# Altium schematic sheet Sheet3.SchDoc
size A; SheetNumber: 1; SheetTotal: 3
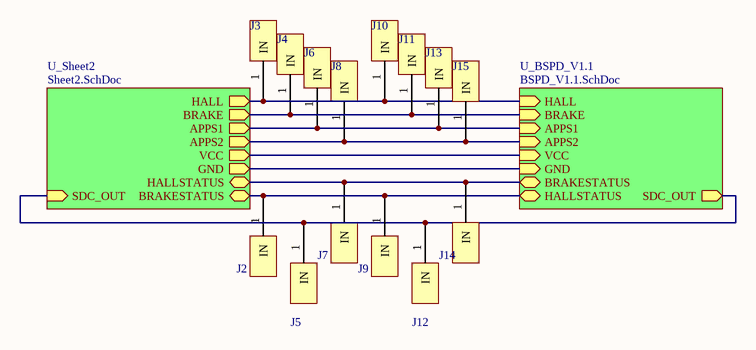
[diagram p0: Sheet3.SchDoc]

## Parts
J2  22AWG JUMPER  [22 AWG Hole]  (value not drawn)
J3  22AWG JUMPER  [22 AWG Hole]  (value not drawn)
J4  22AWG JUMPER  [22 AWG Hole]  (value not drawn)
J5  22AWG JUMPER  [22 AWG Hole]  (value not drawn)
J6  22AWG JUMPER  [22 AWG Hole]  (value not drawn)
J7  22AWG JUMPER  [22 AWG Hole]  (value not drawn)
J8  22AWG JUMPER  [22 AWG Hole]  (value not drawn)
J9  22AWG JUMPER  [22 AWG Hole]  (value not drawn)
J10  22AWG JUMPER  [22 AWG Hole]  (value not drawn)
J11  22AWG JUMPER  [22 AWG Hole]  (value not drawn)
J12  22AWG JUMPER  [22 AWG Hole]  (value not drawn)
J13  22AWG JUMPER  [22 AWG Hole]  (value not drawn)
J14  22AWG JUMPER  [22 AWG Hole]  (value not drawn)
J15  22AWG JUMPER  [22 AWG Hole]  (value not drawn)

## Sub-sheets
U_BSPD_V1.1 = BSPD_V1.1.SchDoc: SDC_OUT (out), HALL (in), BRAKE (in), APPS1 (in), APPS2 (in), VCC (in), GND (in), BRAKESTATUS (bidir), HALLSTATUS (bidir)
U_Sheet2 = Sheet2.SchDoc: SDC_OUT (in), HALL (out), BRAKE (out), APPS1 (out), APPS2 (out), VCC (out), GND (out), BRAKESTATUS (bidir), HALLSTATUS (bidir)

## Nets
NetJ2_1: J2.1(IN) J9.1(IN) ; sheet U_BSPD_V1.1/HALLSTATUS, sheet U_Sheet2/BRAKESTATUS
NetJ3_1: J3.1(IN) J10.1(IN) ; sheet U_BSPD_V1.1/HALL, sheet U_Sheet2/HALL
NetJ4_1: J4.1(IN) J11.1(IN) ; sheet U_BSPD_V1.1/BRAKE, sheet U_Sheet2/BRAKE
NetJ5_1: J5.1(IN) J12.1(IN) ; sheet U_BSPD_V1.1/SDC_OUT, sheet U_Sheet2/SDC_OUT
NetJ6_1: J6.1(IN) J13.1(IN) ; sheet U_BSPD_V1.1/APPS1, sheet U_Sheet2/APPS1
NetJ7_1: J7.1(IN) J14.1(IN) ; sheet U_BSPD_V1.1/BRAKESTATUS, sheet U_Sheet2/HALLSTATUS
NetJ8_1: J8.1(IN) J15.1(IN) ; sheet U_BSPD_V1.1/APPS2, sheet U_Sheet2/APPS2
(unnamed): sheet U_BSPD_V1.1/VCC, sheet U_Sheet2/VCC
(unnamed): sheet U_BSPD_V1.1/GND, sheet U_Sheet2/GND